# Altium schematic sheet DDR3L Bypassing.SchDoc: DDR3L Bypassing
size A4; DrawnBy: Chris Segiet; Revision: v1.0.0
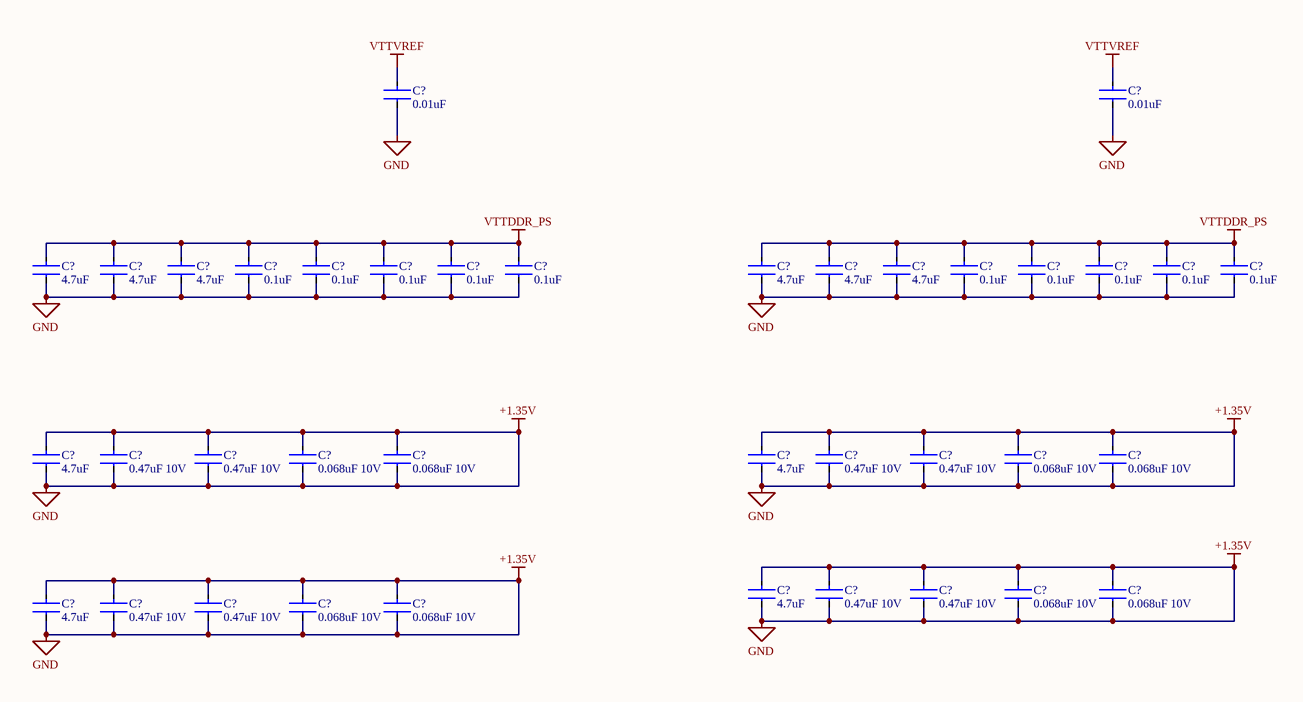
[diagram p0: DDR3L Bypassing.SchDoc]

## Parts
(Parts that share a designator on the sheet are numbered #1, #2 ... from top to bottom, then left to right.)
C?#1  0.01uF  [FP-C1005-050-0_05-IPC_B]
C?#2  0.01uF  [FP-C1005-050-0_05-IPC_B]
C?#3  4.7uF  [FP-C2012-125-0_2-IPC_B]
C?#4  4.7uF  [FP-C2012-125-0_2-IPC_B]
C?#5  4.7uF  [FP-C2012-125-0_2-IPC_B]
C?#6  0.1uF  [FP-CGA3E-0_3-0_1-IPC_B]
C?#7  0.1uF  [FP-CGA3E-0_3-0_1-IPC_B]
C?#8  0.1uF  [FP-CGA3E-0_3-0_1-IPC_B]
C?#9  0.1uF  [FP-CGA3E-0_3-0_1-IPC_B]
C?#10  0.1uF  [FP-CGA3E-0_3-0_1-IPC_B]
C?#11  4.7uF  [FP-C2012-125-0_2-IPC_B]
C?#12  4.7uF  [FP-C2012-125-0_2-IPC_B]
C?#13  4.7uF  [FP-C2012-125-0_2-IPC_B]
C?#14  0.1uF  [FP-CGA3E-0_3-0_1-IPC_B]
C?#15  0.1uF  [FP-CGA3E-0_3-0_1-IPC_B]
C?#16  0.1uF  [FP-CGA3E-0_3-0_1-IPC_B]
C?#17  0.1uF  [FP-CGA3E-0_3-0_1-IPC_B]
C?#18  0.1uF  [FP-CGA3E-0_3-0_1-IPC_B]
C?#19  4.7uF  [FP-C2012-125-0_2-IPC_B]
C?#20  0.47uF 10V  [FP-GRM15-0_1-IPC_B]
C?#21  0.47uF 10V  [FP-GRM15-0_1-IPC_B]
C?#22  0.068uF 10V  [FP-C1005-050-0_05-IPC_B]
C?#23  0.068uF 10V  [FP-C1005-050-0_05-IPC_B]
C?#24  4.7uF  [FP-C2012-125-0_2-IPC_B]
C?#25  0.47uF 10V  [FP-GRM15-0_1-IPC_B]
C?#26  0.47uF 10V  [FP-GRM15-0_1-IPC_B]
C?#27  0.068uF 10V  [FP-C1005-050-0_05-IPC_B]
C?#28  0.068uF 10V  [FP-C1005-050-0_05-IPC_B]
C?#29  4.7uF  [FP-C2012-125-0_2-IPC_B]
C?#30  0.47uF 10V  [FP-GRM15-0_1-IPC_B]
C?#31  0.47uF 10V  [FP-GRM15-0_1-IPC_B]
C?#32  0.068uF 10V  [FP-C1005-050-0_05-IPC_B]
C?#33  0.068uF 10V  [FP-C1005-050-0_05-IPC_B]
C?#34  4.7uF  [FP-C2012-125-0_2-IPC_B]
C?#35  0.47uF 10V  [FP-GRM15-0_1-IPC_B]
C?#36  0.47uF 10V  [FP-GRM15-0_1-IPC_B]
C?#37  0.068uF 10V  [FP-C1005-050-0_05-IPC_B]
C?#38  0.068uF 10V  [FP-C1005-050-0_05-IPC_B]

## Nets
+1.35V: C?#1.2 C?#2.2 C?#3.2 C?#4.2 C?#5.2 C?#6.2 C?#7.2 C?#8.2 C?#9.2 C?#10.2 C?#11.2 C?#12.2 C?#13.2 C?#14.2 C?#15.2 C?#16.2 C?#17.2 C?#18.2 C?#19.1 C?#19.2 C?#20.1 C?#20.2 C?#21.1 C?#21.2 C?#22.1 C?#22.2 C?#23.1 C?#23.2 C?#24.1 C?#24.2 C?#25.1 C?#25.2 C?#26.1 C?#26.2 C?#27.1 C?#27.2 C?#28.1 C?#28.2 C?#29.1 C?#29.2 C?#30.1 C?#30.2 C?#31.1 C?#31.2 C?#32.1 C?#32.2 C?#33.1 C?#33.2 C?#34.1 C?#34.2 C?#35.1 C?#35.2 C?#36.1 C?#36.2 C?#37.1 C?#37.2 C?#38.1 C?#38.2  [also labelled GND]
VTTDDR_PS: C?#3.1 C?#4.1 C?#5.1 C?#6.1 C?#7.1 C?#8.1 C?#9.1 C?#10.1 C?#11.1 C?#12.1 C?#13.1 C?#14.1 C?#15.1 C?#16.1 C?#17.1 C?#18.1
VTTVREF: C?#1.1 C?#2.1

## Notes on the sheet
- Title
- Size:
- Date:
- A3
- Drawn by:
- Time:
- Revision:
- Sheet
- of
- File:

## Library data of the parts
C?#1 C?#2 = CMP-08246-000726-2: Ceramic Capacitor - 10nF ±10% 25V X8R SMD 0402; Dissipation Factor: 3%; Length: 1mm; Capacitance: 10nF; Termination: SMD/SMT; Packaging: Tape and Reel; Weight: 2.3E-05oz; Resistor Type: Ceramic; Case/Package: 0402; Number of Pins: 2; Voltage Rating (DC): 25V; Voltage: 25V; Width: 0.02inch; Tolerance: 10%; Depth: 0.5mm; Case Code (Metric): 1005; Dielectric: X8R; RoHS Compliant: Yes; Max Operating Temperature: 150°C; Features: High Temperature; Voltage Rating: 25V; REACH SVHC: No SVHC; Series: C; Package Quantity: 10000; Mount: Surface Mount; Dielectric Material: Ceramic; Case Code (Imperial): 0402; Lead Free: Lead Free; Thickness: 0.022inch; Height: 0.5mm; Min Operating Temperature: -55°C; Category: Capacitor
C?#3-C?#5 C?#11-C?#13 C?#19 C?#24 C?#29 C?#34 = CMP-08246-004908-1: Ceramic Capacitor  - 4.7μF ±10% 25V X5R SMD 0805; Lead Free: Lead Free; Thickness: 0.057inch; Packaging: Tape and Reel; Min Operating Temperature: -55°C; RoHS Compliant: Yes; Dielectric: X5R; Weight: 0.000194oz; REACH SVHC: No SVHC; Voltage Rating (DC): 25V; Mount: Surface Mount; Capacitance: 4.7uF; Resistor Type: Ceramic; Termination: SMD/SMT; Number of Pins: 2; Case Code (Imperial): 0805; Dielectric Material: Ceramic; Voltage: 25V; Voltage Rating: 25V; Case Code (Metric): 2012; Case/Package: 0805; Max Operating Temperature: 85°C; Height: 1.25mm; Tolerance: 10%; Depth: 1.25mm; Package Quantity: 1; Length: 2mm; Radiation Hardening: No; Width: 1.25mm; Category: Capacitor
C?#6-C?#10 C?#14-C?#18 = CMP-08246-002186-1: Cap Ceramic 100nF 25V X7R 10% Pad SMD 0603 +125°C Automotive T/R; Composition: Ceramic; Dielectric: X7R; Ratings: AEC-Q200; Length: 1.6mm; REACH SVHC: No SVHC; Width: 0.031inch; Packaging: Tape and Reel; Case/Package: 0603; Height: 0.8mm; Termination: SMD/SMT; Max Operating Temperature: 125°C; Thickness: 0.035inch; Case Code (Metric): 1608; Lead Free: Lead Free; Mount: Surface Mount; Voltage Rating (DC): 25V; Capacitance: 100nF; Voltage Rating: 25V; Tolerance: 10%; Weight: 7.1E-05oz; Min Operating Temperature: -55°C; Package Quantity: 1; Depth: 0.8mm; Case Code (Imperial): 0603; Category: Capacitor
C?#20 C?#21 C?#25 C?#26 C?#30 C?#31 C?#35 C?#36 = CMP-2000-05009-2: Ceramic Capacitor - 0.47UF 10V X5R 0402; Manufacturer: Murata Electronics North America; Manufacturer Part Number: GRM155R61A474KE15D; Temperature Coefficient: 15%; Tolerance: 10%; Device Class L3: Ceramic Capacitors; ComponentLink2Description: Datasheet; ComponentLink2URL: https://search.murata.co.jp/Ceramy/image/img/A01X/G101/ENG/GRM155R61A474KE15-01A.pdf; Package: GRM15-0.1; Voltage Rating: 10V; Capacitance: 0.47uF; Category: Cap; Temperature Range High: +85°C; Temperature Range Low: -55°C; Height: 0.55mm; Device Class L2: Capacitors; Lead Free: Yes; Mouser Description: Multilayer Ceramic Capacitors MLCC - SMD/SMT 0402 0.47uF 10volts X5R 10%; Ipc Land Pattern Name: CAPC10050X50; Temperature Characteristic: X5R; Digikey Description: CAP CER 0.47UF 10V X5R 0402; Value: 0.47uF; Octopart: https://octopart.com/grm155r61a474ke15d-murata-196883; Automotive: No; Material: Ceramic; Device Class L1: Passive Components; Temperature: -55°C to +85°C; RoHS: TRUE
C?#22 C?#23 C?#27 C?#28 C?#32 C?#33 C?#37 C?#38 = CMP-03422-000777-1: Ceramic Capacitor - 0.068UF 10V X7R 0402; Manufacturer Part Number: CC0402KRX7R6BB683; Manufacturer: YAGEO; Value: 68 nF; Tolerance: 0.1; Automotive Grade: NA; Temperature Coefficient: 30ppm/°C; Automotive: No; Height: 0.55mm; RoHS: TRUE; Temperature: -55°C to +125°C; Device Class L1: Passive Components; ComponentLink2URL: http://www.yageo.com/documents/recent/UPY-GP_NP0_16V-to-50V_16.pdf; Footprint Url: http://www.yageo.com/exep/pages/download/literatures/UPY-C_GEN_24.pdf; Material: Ceramic; Temperature Range Low: -55°C; Digikey Description: CAP CER 0.068UF 10V X7R 0402; ComponentLink2Description: Datasheet; Temperature Characteristic: X7R; Category: Capacitor; Device Class L2: Capacitors; Lead Free: Yes; Temperature Range High: +125°C; Octopart: https://octopart.com/cc0402krx7r6bb683-yageo-9289272; Capacitance: 68 nF; Package: CC0402; Voltage Rating: 10 V; Device Class L3: Ceramic Capacitors; Mouser Description: Multilayer Ceramic Capacitors MLCC - SMD/SMT 68nF 10V X7R 10%; Ipc Land Pattern Name: CAPC10050X50